# Altium project Repeated_Schematic.PrjPcb
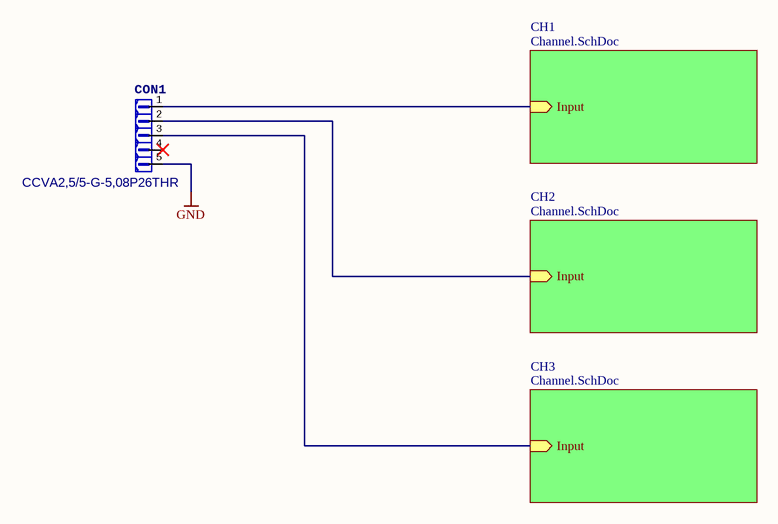
[diagram p0: Repeated_Schematic.SchDoc]
2 sheets, 7 parts. Net scope: hierarchical (ports join the sheet entries above them; power ports are global).
Sheets:
  Repeated_Schematic.SchDoc
    CH1 = Channel.SchDoc
    CH2 = Channel.SchDoc
    CH3 = Channel.SchDoc

## Sheet Repeated_Schematic.SchDoc
size A4; SheetNumber: 1; SheetTotal: 2

### Parts
CON1  CCVA2,5/5-G-5,08P26THR  [CCVA2,5/5-G-5,08P26THR]

### Sub-sheets
CH1 = Channel.SchDoc: Input (in)
CH2 = Channel.SchDoc: Input (in)
CH3 = Channel.SchDoc: Input (in)

### Nets
GND: CON1.5
NetCON1_1: CON1.1 ; sheet CH1/Input
NetCON1_2: CON1.2 ; sheet CH2/Input
NetCON1_3: CON1.3 ; sheet CH3/Input

Not connected (* = marked no-connect by the designer): CON1 4*

### Library data of the parts
CON1 = CCVA2,5/5-G-5,08P26THR: CCVA2,5/5-G-5,08P26THR 7polig 5.08mm Raster; BE-NR: BE-30-00271

## Sheet Channel.SchDoc
size A4; SheetNumber: 2; SheetTotal: 2
Used 3 times, as channels CH1, CH2, CH3. Parts and nets are listed once, with the designators drawn on the sheet.
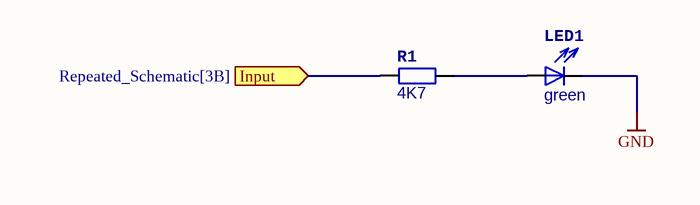
[diagram p1: Channel.SchDoc]

### Parts
LED1  green  [LED0603]
R1  4K7  [R0603]

### Ports
Input (in, see Repeated_Schematic[3B])

### Nets
GND: LED1.C
Input: R1.1 ; port Input
NetLED1_A: LED1.A R1.2

### Channels
CH1: designators end in _CH1; ports Input=NetCON1_1
CH2: designators end in _CH2; ports Input=NetCON1_2
CH3: designators end in _CH3; ports Input=NetCON1_3

### Library data of the parts
LED1 = LED_0603_GREEN: GREEN LED, 0603, 430mcd, 140°, VF 3.2V, VR 5V; BE-NR: BH-90-00064; TMP: -40°C to +85°C; IF: 30mA; ORDER-NO: 150060GS75000; MNF: WE; COLOR: green; VR: 5V; VF: 3.2V; ComponentLink1Description: datasheet; ComponentLink1URL: https://www.we-online.com/components/products/datasheet/150060GS75000.pdf
R1 = 4K7-0603: 4k7,  1%, TK100, 0.1W; BE-NR: BP-11-00141; FOOTPRINT: 0603

## Nets that join several sheets
GND: Repeated_Schematic (CON1.5), CH1 (LED1_CH1.C), CH2 (LED1_CH2.C), CH3 (LED1_CH3.C)
NetCON1_1: Repeated_Schematic (CON1.1), CH1 (R1_CH1.1)
NetCON1_2: Repeated_Schematic (CON1.2), CH2 (R1_CH2.1)
NetCON1_3: Repeated_Schematic (CON1.3), CH3 (R1_CH3.1)